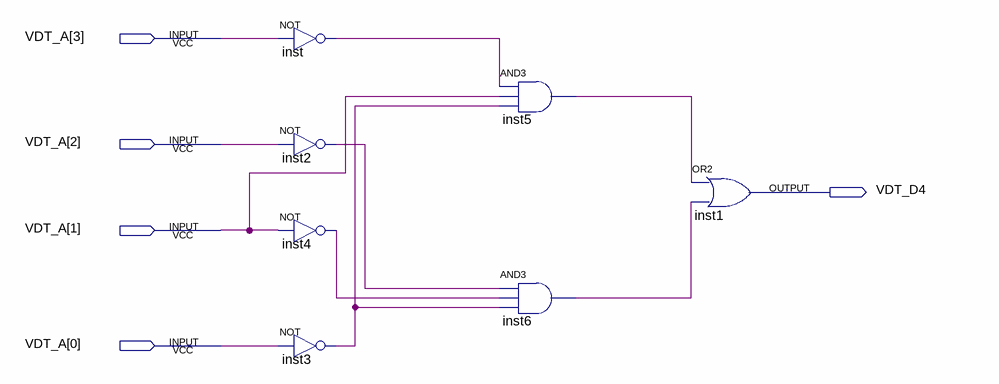
[diagram p0: schematic sheet]
// Quartus schematic D4.bdf as structural Verilog: 7 symbols, 5 pins
module D4 (
  input  [3:0] VDT_A,
  output VDT_D4
);

  wire inst2_out, inst3_out, inst4_out, inst5_out, inst6_out, inst_out;

  not inst (inst_out, VDT_A[3]);
  not inst2 (inst2_out, VDT_A[2]);
  not inst4 (inst4_out, VDT_A[1]);
  not inst3 (inst3_out, VDT_A[0]);
  and inst5 (inst5_out, inst_out, VDT_A[1], inst3_out);
  and inst6 (inst6_out, inst2_out, inst4_out, inst3_out);
  or inst1 (VDT_D4, inst5_out, inst6_out);
endmodule
